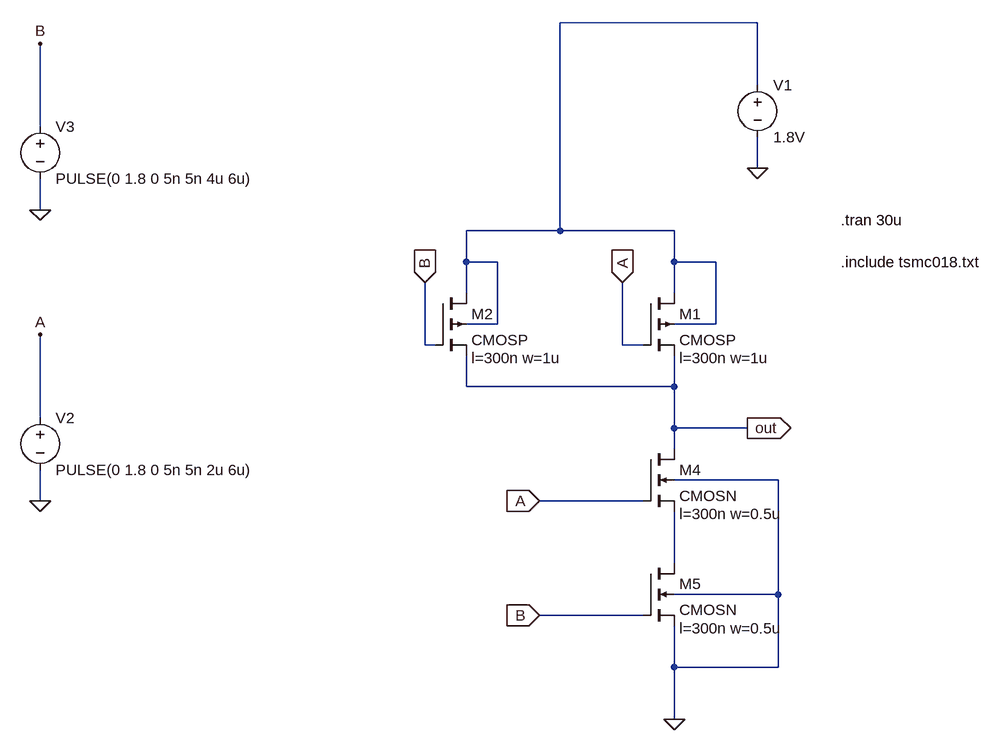
[diagram p0: schematic NAND_2 input.asc]
NAND_2 input.asc, the LTspice schematic file:
Version 4
SHEET 1 880 952
WIRE 304 -336 0 -336
WIRE 304 -240 304 -336
WIRE -800 -176 -800 -304
WIRE 304 -112 304 -160
WIRE -800 -48 -800 -96
WIRE 0 -16 0 -336
WIRE 0 -16 -144 -16
WIRE 176 -16 0 -16
WIRE -144 32 -144 -16
WIRE -96 32 -144 32
WIRE 176 32 176 -16
WIRE 240 32 176 32
WIRE -144 80 -144 32
WIRE 176 80 176 32
WIRE -96 128 -96 32
WIRE -96 128 -144 128
WIRE 240 128 240 32
WIRE 240 128 176 128
WIRE -208 160 -208 64
WIRE -192 160 -208 160
WIRE 96 160 96 64
WIRE 128 160 96 160
WIRE -144 224 -144 176
WIRE 176 224 176 176
WIRE 176 224 -144 224
WIRE -800 272 -800 144
WIRE 176 288 176 224
WIRE 288 288 176 288
WIRE 176 320 176 288
WIRE 336 368 176 368
WIRE -800 400 -800 352
WIRE 128 400 -32 400
WIRE 176 496 176 416
WIRE 336 544 336 368
WIRE 336 544 176 544
WIRE 128 576 -32 576
WIRE 176 656 176 592
WIRE 336 656 336 544
WIRE 336 656 176 656
WIRE 176 736 176 656
FLAG 96 64 A
IOPIN 96 64 In
FLAG -32 400 A
IOPIN -32 400 In
FLAG -208 64 B
IOPIN -208 64 In
FLAG -32 576 B
IOPIN -32 576 In
FLAG 288 288 out
IOPIN 288 288 Out
FLAG 176 736 0
FLAG 304 -112 0
FLAG -800 400 0
FLAG -800 144 A
FLAG -800 -48 0
FLAG -800 -304 B
SYMBOL pmos4 128 80 R0
WINDOW 123 56 100 Left 2
SYMATTR Value2 l=300n w=1u
SYMATTR InstName M1
SYMATTR Value CMOSP
SYMBOL pmos4 -192 80 R0
WINDOW 123 56 100 Left 2
SYMATTR Value2 l=300n w=1u
SYMATTR InstName M2
SYMATTR Value CMOSP
SYMBOL nmos4 128 320 R0
WINDOW 123 56 100 Left 2
SYMATTR Value2 l=300n w=0.5u
SYMATTR InstName M4
SYMATTR Value CMOSN
SYMBOL nmos4 128 496 R0
WINDOW 123 56 100 Left 2
SYMATTR Value2 l=300n w=0.5u
SYMATTR InstName M5
SYMATTR Value CMOSN
SYMBOL voltage 304 -256 R0
WINDOW 123 0 0 Left 0
WINDOW 39 0 0 Left 0
SYMATTR InstName V1
SYMATTR Value 1.8V
SYMBOL voltage -800 256 R0
WINDOW 123 0 0 Left 0
WINDOW 39 0 0 Left 0
SYMATTR InstName V2
SYMATTR Value PULSE(0 1.8 0 5n 5n 2u 6u)
SYMBOL voltage -800 -192 R0
WINDOW 123 0 0 Left 0
WINDOW 39 0 0 Left 0
SYMATTR InstName V3
SYMATTR Value PULSE(0 1.8 0 5n 5n 4u 6u)
TEXT 432 32 Left 2 !.include tsmc018.txt
TEXT 432 -32 Left 2 !.tran 30u

The netlist it stands for:
* NAND_2 input.asc
M1 N001 A out N001 CMOSP l=300n w=1u
M2 N001 B out N001 CMOSP l=300n w=1u
M4 out A N002 0 CMOSN l=300n w=0.5u
M5 N002 B 0 0 CMOSN l=300n w=0.5u
V1 N001 0 1.8V
V2 A 0 PULSE(0 1.8 0 5n 5n 2u 6u)
V3 B 0 PULSE(0 1.8 0 5n 5n 4u 6u)
.model NMOS NMOS
.model PMOS PMOS
.lib standard.mos
.include tsmc018.txt
.tran 30u
.backanno
.end